# EAGLE schematic CD6871X3.7.3 (EAGLE 9.3.0)
CD6871X3.7.3 Car Radio Front Panel Board Schematic
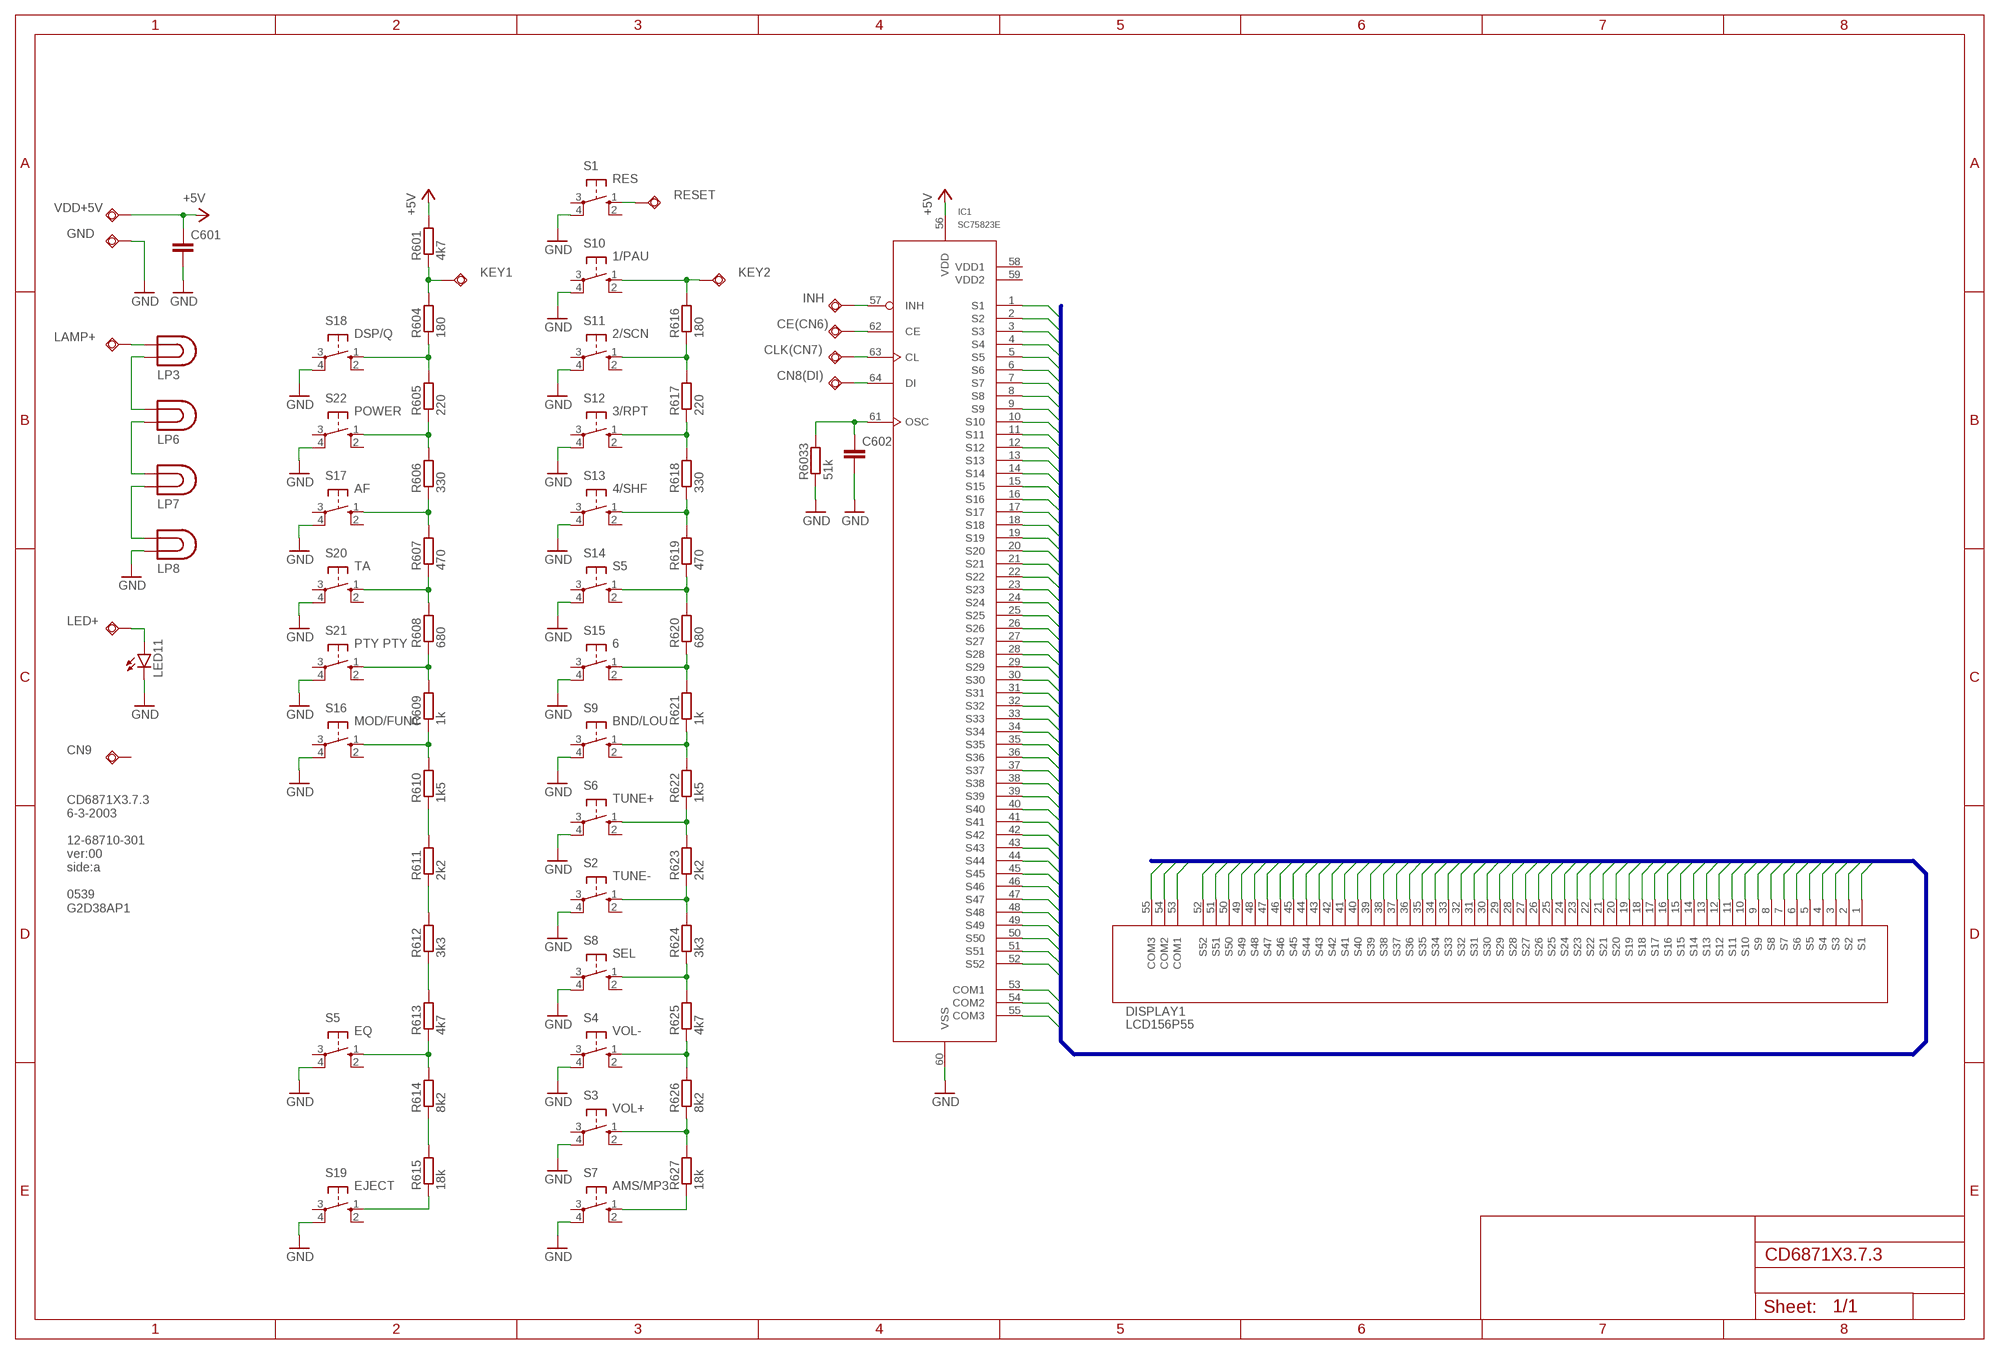
[diagram p0: schematic, sheet 1]

## Parts
C601  C-EUC1310  [C1310]
C602  C-EUC1310  [C1310]
CE(CN6)  TPSQTP20SQ  [TP20SQ]
CLK(CN7)  TPSQTP20SQ  [TP20SQ]
CN8(DI)  TPSQTP20SQ  [TP20SQ]
CN9  TPSQTP20SQ  [TP20SQ]
DISPLAY1  LCD156P55  [LCD156P55]
GND  TPSQTP20SQ  [TP20SQ]
IC1  SC75823E  [QFP64_SOT393]
INH  TPSQTP20SQ  [TP20SQ]
KEY1  TPSQTP20SQ  [TP20SQ]
KEY2  TPSQTP20SQ  [TP20SQ]
LAMP+  TPSQTP20SQ  [TP20SQ]
LED11  LED3MM  [LED3MM]
LED+  TPSQTP20SQ  [TP20SQ]
LP3  LAMP  [LDH-5R]
LP6  LAMP  [LDH-5R]
LP7  LAMP  [LDH-5R]
LP8  LAMP  [LDH-5R]
R601  4k7  R-EU_M1406  [M1406]
R604  180  R-EU_M1406  [M1406]
R605  220  R-EU_M1406  [M1406]
R606  330  R-EU_M1406  [M1406]
R607  470  R-EU_M1406  [M1406]
R608  680  R-EU_M1406  [M1406]
R609  1k  R-EU_M1406  [M1406]
R610  1k5  R-EU_M1406  [M1406]
R611  2k2  R-EU_M1406  [M1406]
R612  3k3  R-EU_M1406  [M1406]
R613  4k7  R-EU_M1406  [M1406]
R614  8k2  R-EU_M1406  [M1406]
R615  18k  R-EU_M1406  [M1406]
R616  180  R-EU_M1406  [M1406]
R617  220  R-EU_M1406  [M1406]
R618  330  R-EU_M1406  [M1406]
R619  470  R-EU_M1406  [M1406]
R620  680  R-EU_M1406  [M1406]
R621  1k  R-EU_M1406  [M1406]
R622  1k5  R-EU_M1406  [M1406]
R623  2k2  R-EU_M1406  [M1406]
R624  3k3  R-EU_M1406  [M1406]
R625  4k7  R-EU_M1406  [M1406]
R626  8k2  R-EU_M1406  [M1406]
R627  18k  R-EU_M1406  [M1406]
R6033  51k  R-EU_M1406  [M1406]
RESET  TPSQTP20SQ  [TP20SQ]
S1  RES  10-XX  [B3F-10XX]
S2  TUNE-  10-XX  [B3F-10XX]
S3  VOL+  10-XX  [B3F-10XX]
S4  VOL-  10-XX  [B3F-10XX]
S5  EQ  10-XX  [B3F-10XX]
S6  TUNE+  10-XX  [B3F-10XX]
S7  AMS/MP3  10-XX  [B3F-10XX]
S8  SEL  10-XX  [B3F-10XX]
S9  BND/LOU  10-XX  [B3F-10XX]
S10  1/PAU  10-XX  [B3F-10XX]
S11  2/SCN  10-XX  [B3F-10XX]
S12  3/RPT  10-XX  [B3F-10XX]
S13  4/SHF  10-XX  [B3F-10XX]
S14  S5  10-XX  [B3F-10XX]
S15  6  10-XX  [B3F-10XX]
S16  MOD/FUNC  10-XX  [B3F-10XX]
S17  AF  10-XX  [B3F-10XX]
S18  DSP/Q  10-XX  [B3F-10XX]
S19  EJECT  10-XX  [B3F-10XX]
S20  TA  10-XX  [B3F-10XX]
S21  PTY PTY  10-XX  [B3F-10XX]
S22  POWER  10-XX  [B3F-10XX]
VDD+5V  TPSQTP20SQ  [TP20SQ]

## Nets
+5V: C601.1 IC1.56(VDD) R601.2 VDD+5V.TP
B$1: DISPLAY1.1(S1) IC1.1(S1)
B$2: DISPLAY1.2(S2) IC1.2(S2)
B$3: DISPLAY1.3(S3) IC1.3(S3)
B$4: DISPLAY1.4(S4) IC1.4(S4)
B$5: DISPLAY1.5(S5) IC1.5(S5)
B$6: DISPLAY1.6(S6) IC1.6(S6)
B$7: DISPLAY1.7(S7) IC1.7(S7)
B$8: DISPLAY1.8(S8) IC1.8(S8)
B$9: DISPLAY1.9(S9) IC1.9(S9)
B$10: DISPLAY1.10(S10) IC1.10(S10)
B$11: DISPLAY1.11(S11) IC1.11(S11)
B$12: DISPLAY1.12(S12) IC1.12(S12)
B$13: DISPLAY1.13(S13) IC1.13(S13)
B$14: DISPLAY1.14(S14) IC1.14(S14)
B$15: DISPLAY1.15(S15) IC1.15(S15)
B$16: DISPLAY1.16(S16) IC1.16(S16)
B$17: DISPLAY1.17(S17) IC1.17(S17)
B$18: DISPLAY1.18(S18) IC1.18(S18)
B$19: DISPLAY1.19(S19) IC1.19(S19)
B$20: DISPLAY1.20(S20) IC1.20(S20)
B$21: DISPLAY1.21(S21) IC1.21(S21)
B$22: DISPLAY1.22(S22) IC1.22(S22)
B$23: DISPLAY1.23(S23) IC1.23(S23)
B$24: DISPLAY1.24(S24) IC1.24(S24)
B$25: DISPLAY1.25(S25) IC1.25(S25)
B$26: DISPLAY1.26(S26) IC1.26(S26)
B$27: DISPLAY1.27(S27) IC1.27(S27)
B$28: DISPLAY1.28(S28) IC1.28(S28)
B$29: DISPLAY1.29(S29) IC1.29(S29)
B$30: DISPLAY1.30(S30) IC1.30(S30)
B$31: DISPLAY1.31(S31) IC1.31(S31)
B$32: DISPLAY1.32(S32) IC1.32(S32)
B$33: DISPLAY1.33(S33) IC1.33(S33)
B$34: DISPLAY1.34(S34) IC1.34(S34)
B$35: DISPLAY1.35(S35) IC1.35(S35)
B$36: DISPLAY1.36(S36) IC1.36(S36)
B$37: DISPLAY1.37(S37) IC1.37(S37)
B$38: DISPLAY1.38(S38) IC1.38(S38)
B$39: DISPLAY1.39(S39) IC1.39(S39)
B$40: DISPLAY1.40(S40) IC1.40(S40)
B$41: DISPLAY1.41(S41) IC1.41(S41)
B$42: DISPLAY1.42(S42) IC1.42(S42)
B$43: DISPLAY1.43(S43) IC1.43(S43)
B$44: DISPLAY1.44(S44) IC1.44(S44)
B$45: DISPLAY1.45(S45) IC1.45(S45)
B$46: DISPLAY1.46(S46) IC1.46(S46)
B$47: DISPLAY1.47(S47) IC1.47(S47)
B$48: DISPLAY1.48(S48) IC1.48(S48)
B$49: DISPLAY1.49(S49) IC1.49(S49)
B$50: DISPLAY1.50(S50) IC1.50(S50)
B$51: DISPLAY1.51(S51) IC1.51(S51)
B$52: DISPLAY1.52(S52) IC1.52(S52)
B$53: DISPLAY1.53(COM1) IC1.53(COM1)
B$54: DISPLAY1.54(COM2) IC1.54(COM2)
B$55: DISPLAY1.55(COM3) IC1.55(COM3)
GND: C601.2 C602.2 GND.TP IC1.60(VSS) LED11.K(C) LP8.1 R6033.1 S1.4(P1) S2.4(P1) S3.4(P1) S4.4(P1) S5.4(P1) S6.4(P1) S7.4(P1) S8.4(P1) S9.4(P1) S10.4(P1) S11.4(P1) S12.4(P1) S13.4(P1) S14.4(P1) S15.4(P1) S16.4(P1) S17.4(P1) S18.4(P1) S19.4(P1) S20.4(P1) S21.4(P1) S22.4(P1)
N$1: IC1.57(INH) INH.TP
N$2: CE(CN6).TP IC1.62(CE)
N$3: CLK(CN7).TP IC1.63(CL)
N$4: C602.1 IC1.61(OSC) R6033.2
N$5: CN8(DI).TP IC1.64(DI)
N$8: KEY1.TP R601.1 R604.2
N$9: R604.1 R605.2 S18.1(S)
N$10: R613.1 R614.2 S5.1(S)
N$11: R612.1 R613.2
N$12: R611.1 R612.2
N$13: R610.1 R611.2
N$14: R609.1 R610.2 S16.1(S)
N$15: R608.1 R609.2 S21.1(S)
N$16: R607.1 R608.2 S20.1(S)
N$17: R606.1 R607.2 S17.1(S)
N$18: R605.1 R606.2 S22.1(S)
N$19: R614.1 R615.2
N$20: R615.1 S19.1(S)
N$21: KEY2.TP R616.2 S10.1(S)
N$22: R616.1 R617.2 S11.1(S)
N$23: R617.1 R618.2 S12.1(S)
N$24: R618.1 R619.2 S13.1(S)
N$25: R619.1 R620.2 S14.1(S)
N$26: R620.1 R621.2 S15.1(S)
N$27: R621.1 R622.2 S9.1(S)
N$28: R622.1 R623.2 S6.1(S)
N$29: R623.1 R624.2 S2.1(S)
N$30: R624.1 R625.2 S8.1(S)
N$31: R625.1 R626.2 S4.1(S)
N$32: R626.1 R627.2 S3.1(S)
N$33: R627.1 S7.1(S)
N$34: RESET.TP S1.1(S)
N$35: LED11.A LED+.TP
N$36: LAMP+.TP LP3.2
N$39: LP3.1 LP6.2
N$40: LP6.1 LP7.2
N$41: LP7.1 LP8.2
Unconnected: CN9.TP IC1.58(VDD1) IC1.59(VDD2) S1.2(S1) S1.3(P) S2.2(S1) S2.3(P) S3.2(S1) S3.3(P) S4.2(S1) S4.3(P) S5.2(S1) S5.3(P) S6.2(S1) S6.3(P) S7.2(S1) S7.3(P) S8.2(S1) S8.3(P) S9.2(S1) S9.3(P) S10.2(S1) S10.3(P) S11.2(S1) S11.3(P) S12.2(S1) S12.3(P) S13.2(S1) S13.3(P) S14.2(S1) S14.3(P) S15.2(S1) S15.3(P) S16.2(S1) S16.3(P) S17.2(S1) S17.3(P) S18.2(S1) S18.3(P) S19.2(S1) S19.3(P) S20.2(S1) S20.3(P) S21.2(S1) S21.3(P) S22.2(S1) S22.3(P)

## Buses
BDISPLAY:B$[1..55]

## Notes on the sheet
- CD6871X3.7.3
  6-3-2003
  
  12-68710-301
  ver:00
  side:a
  
  0539
  G2D38AP1

## Library data of the parts
C601 C602 = rcl:C-EU: CAPACITOR, European symbol; SPICEPREFIX: C
CE(CN6) CLK(CN7) CN8(DI) CN9 GND INH KEY1 KEY2 LAMP+ LED+ RESET VDD+5V = testpad:TPSQ: Test pad
DISPLAY1 = CD6871X3.7.3:LCD156P55: 156 Segment Car Radio LCD
IC1 = CD6871X3.7.3:SC75823E: 1/3 duty general-purpose LCD driver Manufacturer: Silan Semiconductors The SC75823E/W is a general-purpose LCD driver that can be used for frequency display in microprocessor-controlled radio receives and in other display applications. In addition to being able to directly drive up to 156 LCD segments. Datasheet: http://pdf.dzsc.com/SC7/SC75823.pdf
LED11 = led:LED: LED OSRAM: - CHIPLED LG R971, LG N971, LY N971, LG Q971, LY Q971, LO R971, LY R971 LH N974, LH R974 LS Q976, LO Q976, LY Q976 LO Q996 - Hyper CHIPLED LW Q18S LB Q993, LB Q99A, LB R99A - SideLED LS A670, LO A670, LY A670, LG A670, LP A670 LB A673, LV A673, LT A673, LW A673 LH A674 LY A675 LS A676, LA A676, LO A676, LY A676, LW A676 LS A679, LY A679, LG A679 - Hyper Micro SIDELED® LS Y876, LA Y876, LO Y876, LY Y876 LT Y87S - SmartLED LW L88C, LW L88S LB L89C, LB L89S, LG L890 LS L89K, LO L89K, LY L89K LS L896, LA L896, LO L896, LY L896 - TOPLED LS T670, LO T670, LY T670, LG T670, LP T670 LSG T670, LSP T670, LSY T670, LOP T670, LYG T670 LG T671, LOG T671, LSG T671 LB T673, LV T673, LT T673, LW T673 LH T674 LS T676, LA T676, LO T676, LY T676, LB T676, LH T676, LSB T676, LW T676 LB T67C, LV T67C, LT T67C, LS T67K, LO T67K, LY T67K, LW E67C LS E67B, LA E67B, LO E67B, LY E67B, LB E67C, LV E67C, LT E67C LW T67C LS T679, LY T679, LG T679 LS T770, LO T770, LY T770, LG T770, LP T770 LB T773, LV T773, LT T773, LW T773 LH T774 LS E675, LA E675, LY E675, LS T675 LS T776, LA T776, LO T776, LY T776, LB T776 LHGB T686 LT T68C, LB T68C - Hyper Mini TOPLED® LB M676 - Mini TOPLED Santana® LG M470 LS M47K, LO M47K, LY M47K Source: http://www.osram.convergy.de LUXEON: - LUMILED® LXK2-PW12-R00, LXK2-PW12-S00, LXK2-PW14-U00, LXK2-PW14-V00 LXK2-PM12-R00, LXK2-PM12-S00, LXK2-PM14-U00 LXK2-PE12-Q00, LXK2-PE12-R00, LXK2-PE12-S00, LXK2-PE14-T00, LXK2-PE14-U00 LXK2-PB12-K00, LXK2-PB12-L00, LXK2-PB12-M00, LXK2-PB14-N00, LXK2-PB14-P00, LXK2-PB14-Q00 LXK2-PR12-L00, LXK2-PR12-M00, LXK2-PR14-Q00, LXK2-PR14-R00 LXK2-PD12-Q00, LXK2-PD12-R00, LXK2-PD12-S00 LXK2-PH12-R00, LXK2-PH12-S00 LXK2-PL12-P00, LXK2-PL12-Q00, LXK2-PL12-R00 Source: www.luxeon.com KINGBRIGHT: KA-3528ASYC Source: www.kingbright.com
LP3 LP6-LP8 = special:LAMP: LED HOLDER
R601 R604-R627 R6033 = rcl:R-EU_: RESISTOR, European symbol; SPICEPREFIX: R
S1-S22 = switch-omron:10-XX: OMRON SWITCH; MPN: B3F-1000; OC_FARNELL: 176432; OC_NEWARK: 36M3542